# EasyEDA schematic Pi-Fan-Controller_2021-02-07-eda-export.json
TITLE: Mainboard; REV: 1.0; Date: 2021-02-01; Sheet: 1/1; Drawn By: danny-andersen; Company: Your Company
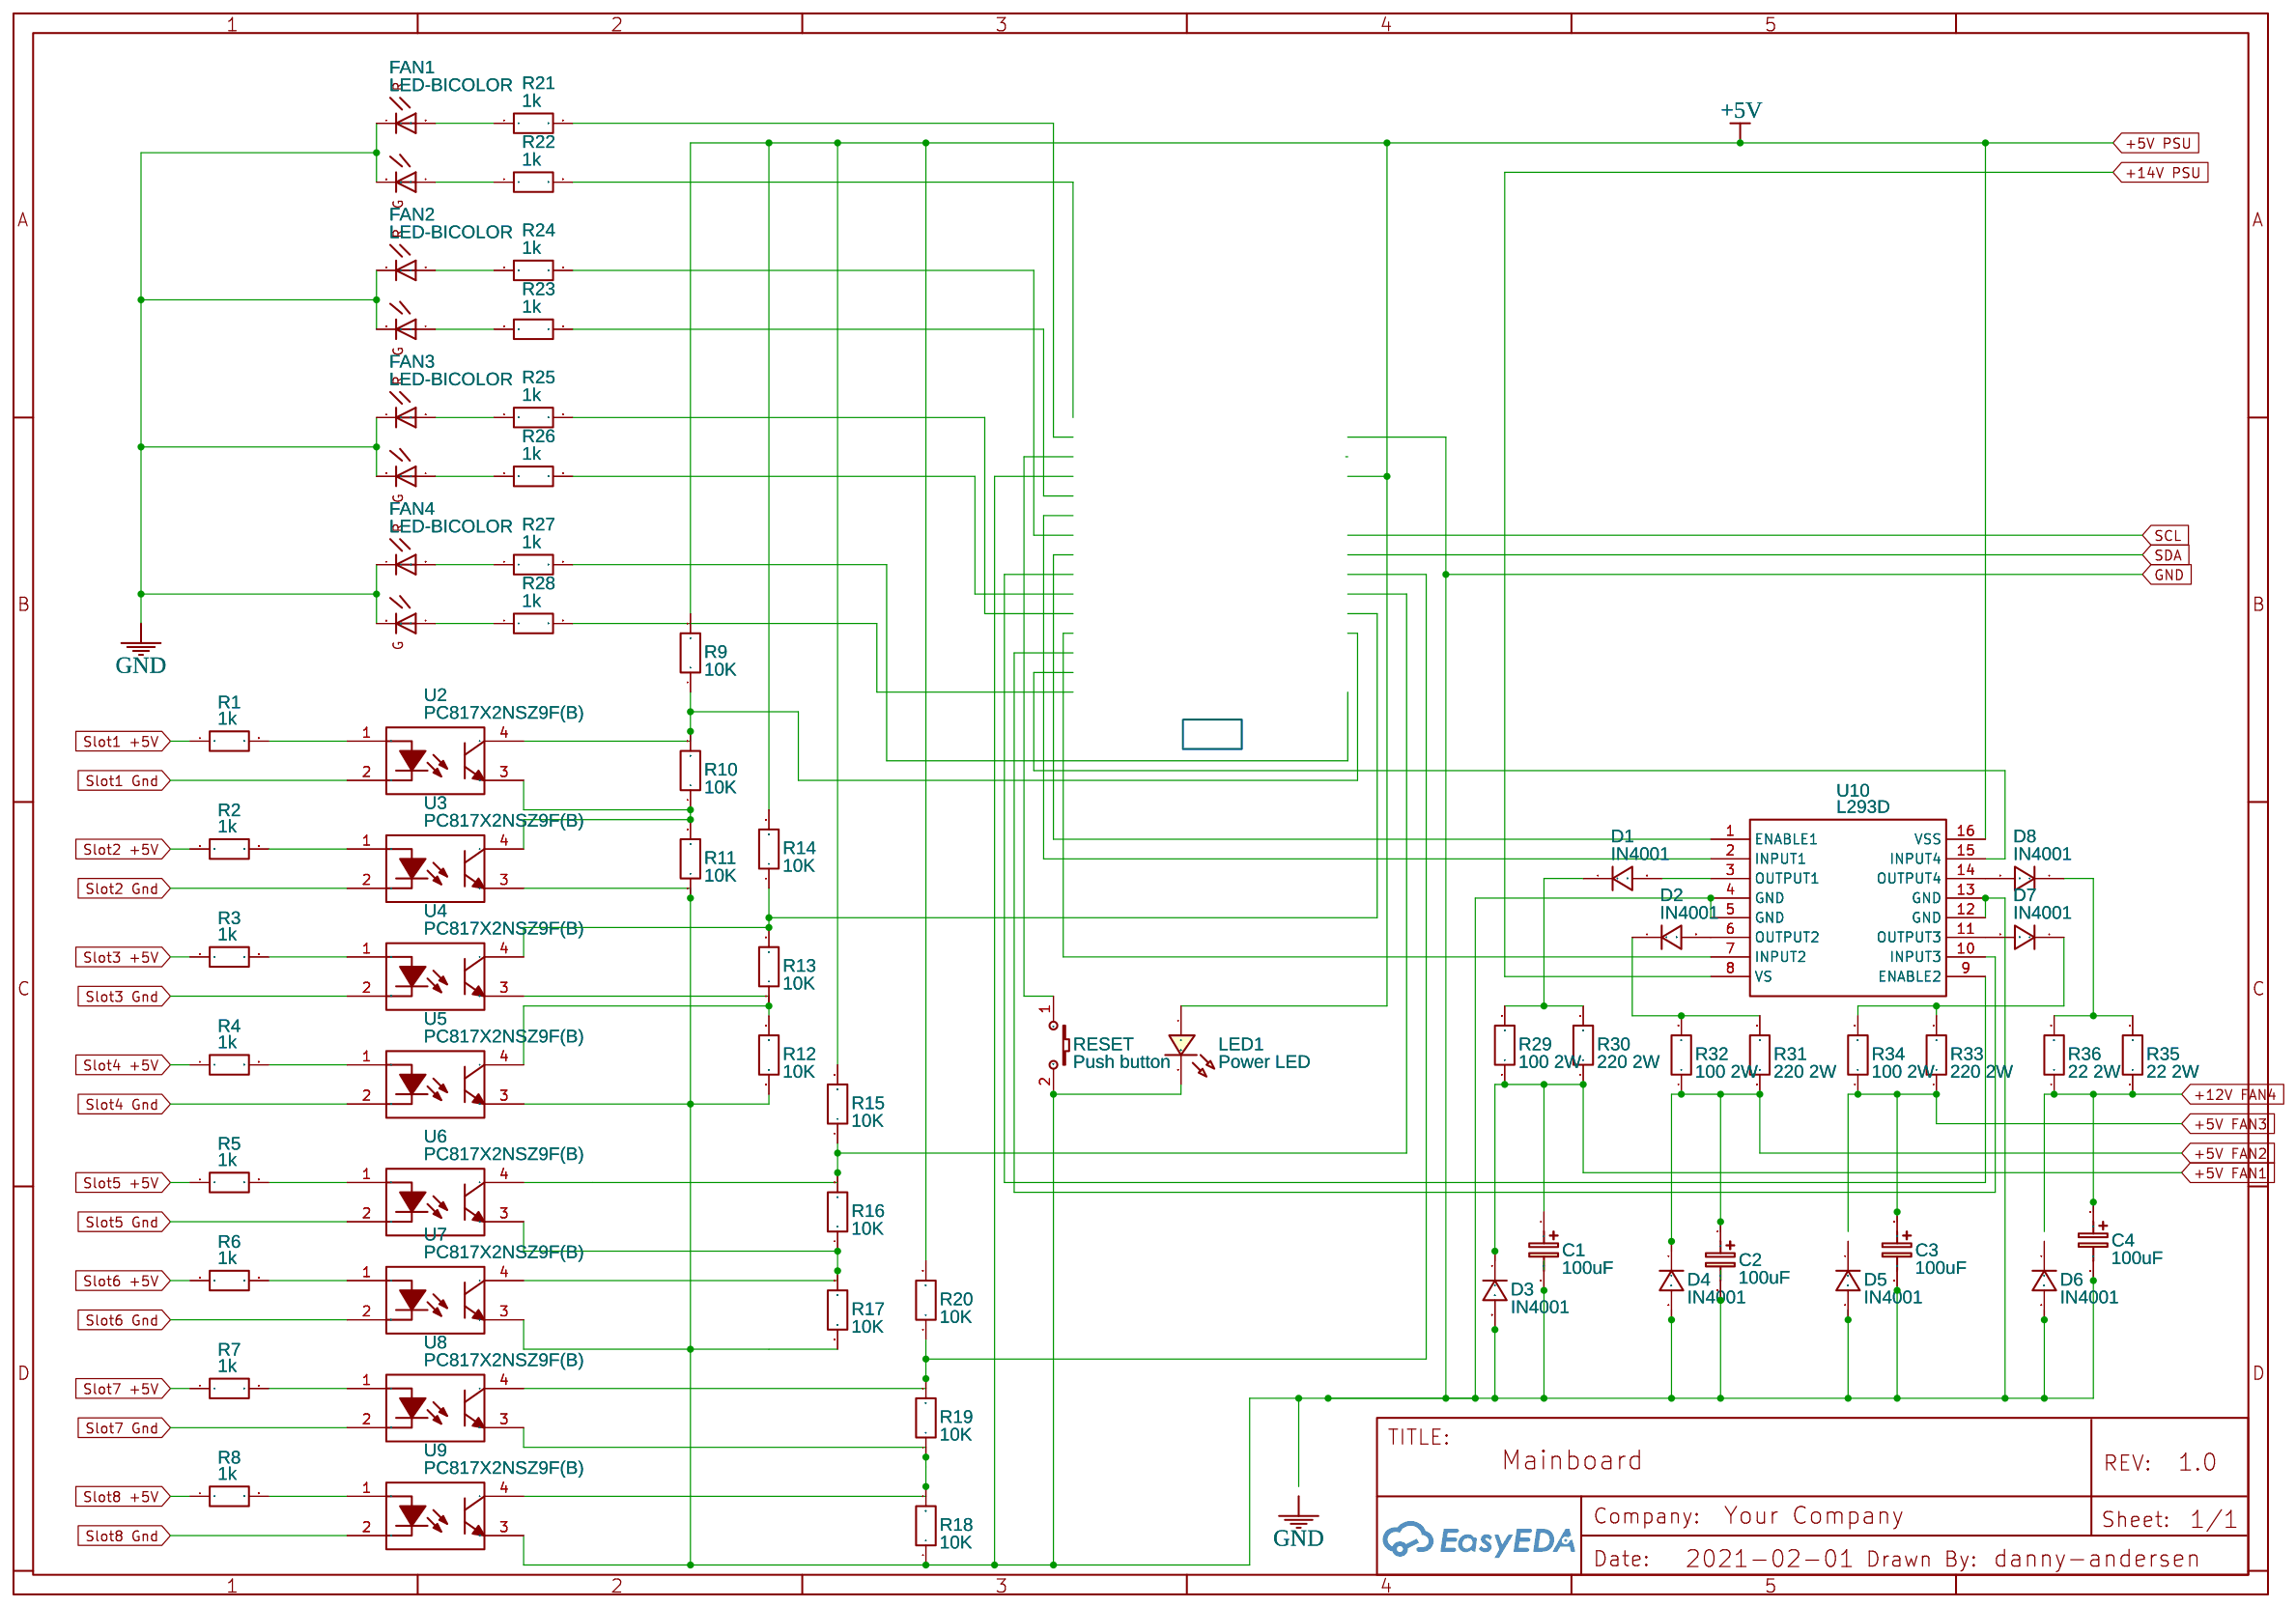
[diagram p0: schematic sheet]

## Parts
C1  100uF  [CASE-A_3216]
C2  100uF  [CASE-A_3216]
C3  100uF  [CASE-A_3216]
C4  100uF  [CASE-A_3216]
D1  IN4001  [IN4001]
D2  IN4001  [IN4001]
D3  IN4001  [IN4001]
D4  IN4001  [IN4001]
D5  IN4001  [IN4001]
D6  IN4001  [IN4001]
D7  IN4001  [IN4001]
D8  IN4001  [IN4001]
FAN1  LED-BICOLOR  [LED-BICOLOR]
FAN2  LED-BICOLOR  [LED-BICOLOR]
FAN3  LED-BICOLOR  [LED-BICOLOR]
FAN4  LED-BICOLOR  [LED-BICOLOR]
LED1  Power LED  [LED0603_RED]
R1  1k  [R0603]
R2  1k  [R0603]
R3  1k  [R0603]
R4  1k  [R0603]
R5  1k  [R0603]
R6  1k  [R0603]
R7  1k  [R0603]
R8  1k  [R0603]
R9  10K  [R0603]
R10  10K  [R0603]
R11  10K  [R0603]
R12  10K  [R0603]
R13  10K  [R0603]
R14  10K  [R0603]
R15  10K  [R0603]
R16  10K  [R0603]
R17  10K  [R0603]
R18  10K  [R0603]
R19  10K  [R0603]
R20  10K  [R0603]
R21  1k  [R0603]
R22  1k  [R0603]
R23  1k  [R0603]
R24  1k  [R0603]
R25  1k  [R0603]
R26  1k  [R0603]
R27  1k  [R0603]
R28  1k  [R0603]
R29  100 2W  [R0603]
R30  220 2W  [R0603]
R31  220 2W  [R0603]
R32  100 2W  [R0603]
R33  220 2W  [R0603]
R34  100 2W  [R0603]
R35  22 2W  [R0603]
R36  22 2W  [R0603]
RESET  Push button  [KEY-SMD_2P-L6.2-W3.6-LS8.0]
U2  PC817X2NSZ9F(B)  [DIP-4_L6.4-W4.6-P2.54-LS7.6-BL]
U3  PC817X2NSZ9F(B)  [DIP-4_L6.4-W4.6-P2.54-LS7.6-BL]
U4  PC817X2NSZ9F(B)  [DIP-4_L6.4-W4.6-P2.54-LS7.6-BL]
U5  PC817X2NSZ9F(B)  [DIP-4_L6.4-W4.6-P2.54-LS7.6-BL]
U6  PC817X2NSZ9F(B)  [DIP-4_L6.4-W4.6-P2.54-LS7.6-BL]
U7  PC817X2NSZ9F(B)  [DIP-4_L6.4-W4.6-P2.54-LS7.6-BL]
U8  PC817X2NSZ9F(B)  [DIP-4_L6.4-W4.6-P2.54-LS7.6-BL]
U9  PC817X2NSZ9F(B)  [DIP-4_L6.4-W4.6-P2.54-LS7.6-BL]
U10  L293D  [DIP-16_L20.0-W6.4-P2.54-LS7.6-BL]

## Library data of the parts
C1-C4 = C_Tan_SMD_A_EU: Contributor: LCEDA_Lib
D1-D8 = IN4001: Contributor: sccousins
FAN1-FAN4 = -: LED-Bicolor  RedGreen; catid: 20; Contributor: Pinoccio; Manufacturer Part: ?
LED1 = LED-0603_R: Manufacturer: EVERLIGHT(台湾亿光); Manufacturer Part: 19-217/R6C-AL1M2VY/3T; Supplier Part: C72044; Supplier: LCSC; Contributor: LCEDA_01
R1-R36 = R_0603_EU: Contributor: LCEDA_Lib
RESET = K2-3.6×6.1_SMD: Supplier Part: C118141; Supplier: LCSC; Manufacturer Part: K2-1107ST-A4SW-06; Contributor: LCEDA_Lib; 制造商: 韩国韩荣
U2-U9 = PC817X2NSZ9F(B): Supplier: LCSC; Manufacturer: SHARP; image: //image.lceda.cn/szlcsc/C60965.jpg; Supplier Part: C60965
U10 = L293D: Contributor: pitreluc; Supplier: LCSC; Manufacturer: STMicroelectronics; image: //image.lceda.cn/szlcsc/C12340.jpg; Supplier Part: C12340

## Nets
+5V: LED1.1 R9.2 R14.2 R15.2 R20.2 U10.16(VSS)
+5V FAN1: C1.1 D3.1 R29.1 R30.1
+5V FAN2: C2.1 D4.1 R31.1 R32.1
+5V FAN3: C3.1 R33.1 R34.1
+12V FAN4: C4.1 R35.1 R36.1
+14V PSU: U10.8(VS)
GND: C1.2 C2.2 C3.2 C4.2 D3.2 D4.2 D5.2 D6.2 FAN1.3 FAN1.4 FAN2.3 FAN2.4 FAN3.3 FAN3.4 FAN4.3 FAN4.4 LED1.2 R11.1 R12.1 R17.1 R18.1 RESET.2 U3.3 U5.3 U7.3 U9.3 U10.4(GND) U10.5(GND) U10.12(GND) U10.13(GND)
Slot1 +5V: R1.1
Slot1 Gnd: U2.2
Slot2 +5V: R2.1
Slot2 Gnd: U3.2
Slot3 +5V: R3.1
Slot3 Gnd: U4.2
Slot4 +5V: R4.1
Slot4 Gnd: U5.2
Slot5 +5V: R5.1
Slot5 Gnd: U6.2
Slot6 +5V: R6.1
Slot6 Gnd: U7.2
Slot7 +5V: R7.1
Slot7 Gnd: U8.2
Slot8 +5V: R8.1
Slot8 Gnd: U9.2
Net-(D1-1): D1.1 R29.2 R30.2
Net-(D1-2): D1.2 U10.3(OUTPUT1)
Net-(D2-1): D2.1 R31.2 R32.2
Net-(D2-2): D2.2 U10.6(OUTPUT2)
Net-(D7-1): D7.1 R33.2 R34.2
Net-(D7-2): D7.2 U10.11(OUTPUT3)
Net-(D8-1): D8.1 R35.2 R36.2
Net-(D8-2): D8.2 U10.14(OUTPUT4)
Net-(FAN1-1): FAN1.1 R22.1
Net-(FAN1-2): FAN1.2 R21.1
Net-(FAN2-1): FAN2.1 R23.1
Net-(FAN2-2): FAN2.2 R24.1
Net-(FAN3-1): FAN3.1 R26.1
Net-(FAN3-2): FAN3.2 R25.1
Net-(FAN4-1): FAN4.1 R28.1
Net-(FAN4-2): FAN4.2 R27.1
Net-(R1-2): R1.2 U2.1
Net-(R2-2): R2.2 U3.1
Net-(R3-2): R3.2 U4.1
Net-(R4-2): R4.2 U5.1
Net-(R5-2): R5.2 U6.1
Net-(R6-2): R6.2 U7.1
Net-(R7-2): R7.2 U8.1
Net-(R8-2): R8.2 U9.1
Net-(R9-1): R9.1 R10.2 U2.4
Net-(R10-1): R10.1 R11.2 U2.3 U3.4
Net-(R12-2): R12.2 R13.1 U4.3 U5.4
Net-(R13-2): R13.2 R14.1 U4.4
Net-(R15-1): R15.1 R16.2 U6.4
Net-(R16-1): R16.1 R17.2 U6.3 U7.4
Net-(R18-2): R18.2 R19.1 U8.3 U9.4
Net-(R19-2): R19.2 R20.1 U8.4

Not connected (* = marked no-connect by the designer): D5 1; D6 1; R21 2; R22 2; R23 2; R24 2; R25 2; R26 2; R27 2; R28 2; RESET 1; U10 1(ENABLE1) 2(INPUT1) 7(INPUT2) 9(ENABLE2) 10(INPUT3) 15(INPUT4)
